# Altium project Power Board.PrjPcb
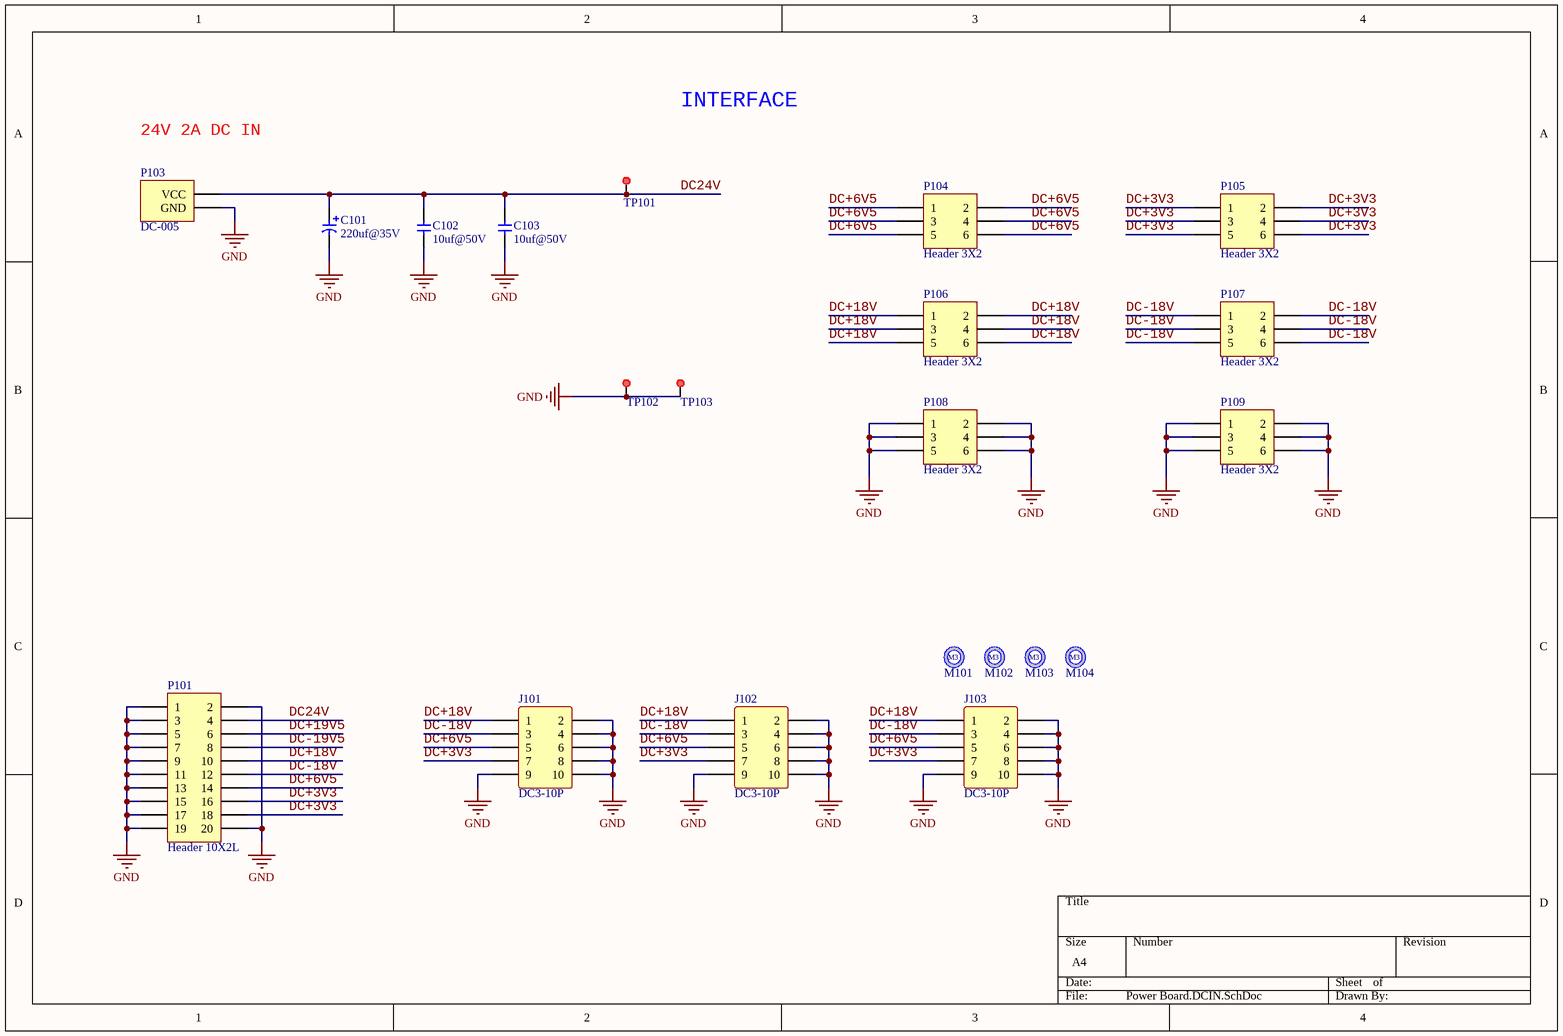
[diagram p0: Power Board.DCIN.SchDoc]
3 sheets, 67 parts. Net scope: global (net labels, ports and power ports of the same name join across sheets).
Board file: Power Board.PcbDoc
Sheets:
  Power Board.DCIN.SchDoc
  Power Board.LDO.SchDoc
  Power Board.DCDC2.SchDoc

## Sheet Power Board.DCIN.SchDoc
size A4; SheetNumber: 1; SheetTotal: 2

### Parts
C101  value 220uf@35V  [C8X12]  (hidden comment: Cap2)
C102  value 10uf@50V  [C1206]  (hidden comment: Cap)
C103  value 10uf@50V  [C1206]  (hidden comment: Cap)
J101  DC3-10P  [DC3-10P]
J102  DC3-10P  [DC3-10P]
J103  DC3-10P  [DC3-10P]
M101  M3  [M3-3.2X5]  (value not drawn)
M102  M3  [M3-3.2X5]  (value not drawn)
M103  M3  [M3-3.2X5]  (value not drawn)
M104  M3  [M3-3.2X5]  (value not drawn)
P101  Header 10X2L  [HDR2X10LML]
P103  DC-005  [DC-005]
P104  Header 3X2  [HDR2X3]
P105  Header 3X2  [HDR2X3]
P106  Header 3X2  [HDR2X3]
P107  Header 3X2  [HDR2X3]
P108  Header 3X2  [HDR2X3]
P109  Header 3X2  [HDR2X3]
TP101  TestPoint  [TestPoint-THM1.0-L]  (value not drawn)
TP102  TestPoint  [TestPoint-THM1.0-L]  (value not drawn)
TP103  TestPoint  [TestPoint-THM1.0-L]  (value not drawn)

### Nets
GND: C101.2 C102.1 C103.1 J101.2 J101.4 J101.6 J101.8 J101.9 J101.10 J102.2 J102.4 J102.6 J102.8 J102.9 J102.10 J103.2 J103.4 J103.6 J103.8 J103.9 J103.10 P101.1 P101.2 P101.3 P101.5 P101.7 P101.9 P101.11 P101.13 P101.15 P101.17 P101.19 P101.20 P103.2(GND) P108.1 P108.2 P108.3 P108.4 P108.5 P108.6 P109.1 P109.2 P109.3 P109.4 P109.5 P109.6 TP102.1 TP103.1
DC24V: C101.1 C102.2 C103.2 P101.4 P103.1(VCC) TP101.1
DC+3V3: J101.7 J102.7 J103.7 P101.16 P101.18 P105.1 P105.2 P105.3 P105.4 P105.5 P105.6
DC+6V5: J101.5 J102.5 J103.5 P101.14 P104.1 P104.2 P104.3 P104.4 P104.5 P104.6
DC+18V: J101.1 J102.1 J103.1 P101.10 P106.1 P106.2 P106.3 P106.4 P106.5 P106.6
DC+19V5: P101.6
DC-18V: J101.3 J102.3 J103.3 P101.12 P107.1 P107.2 P107.3 P107.4 P107.5 P107.6
DC-19V5: P101.8

### Notes on the sheet
- INTERFACE
- 24V 2A DC IN

### Library data of the parts
P101 = Header 10X2L: Header, 10-Pin, Dual row, Pin 1 on Left
P104-P109 = Header 3X2: Header, 3-Pin, Dual row
TP101-TP103 = TestPoint: 测试点

## Sheet Power Board.LDO.SchDoc
size A4; SheetNumber: 2; SheetTotal: 2
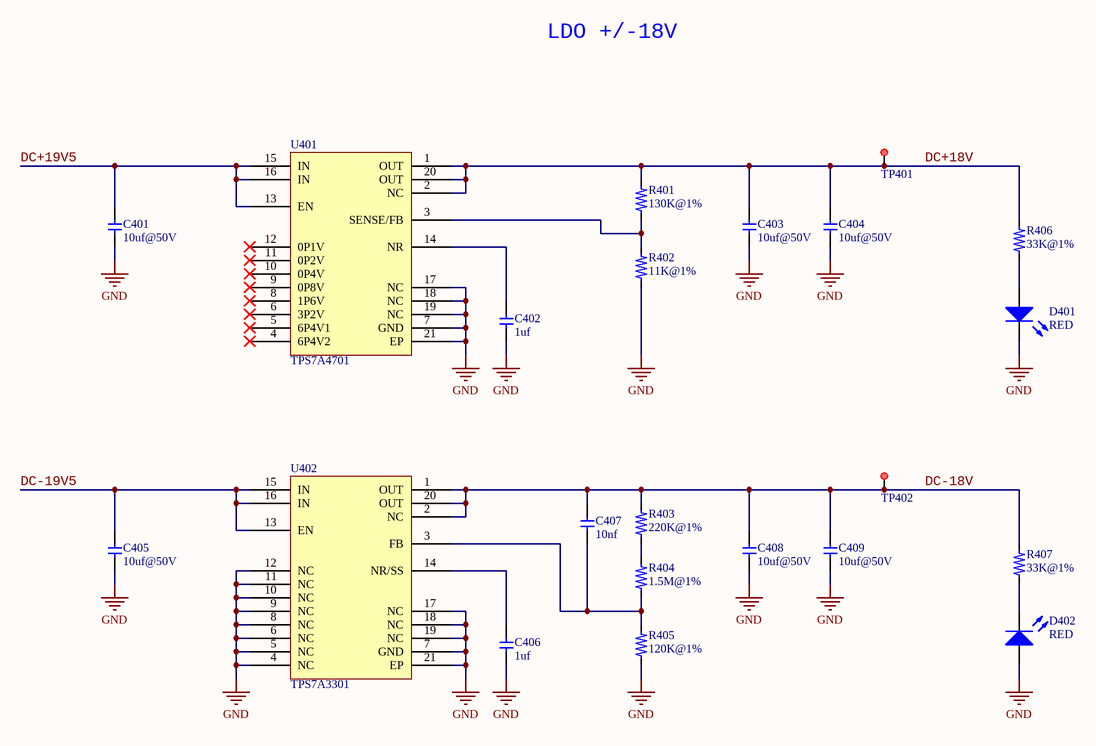
[diagram p1: Power Board.LDO.SchDoc]

### Parts
C401  value 10uf@50V  [C1206]  (hidden comment: Cap)
C402  value 1uf  [C0603]  (hidden comment: Cap)
C403  value 10uf@50V  [C1206]  (hidden comment: Cap)
C404  value 10uf@50V  [C1206]  (hidden comment: Cap)
C405  value 10uf@50V  [C1206]  (hidden comment: Cap)
C406  value 1uf  [C0603]  (hidden comment: Cap)
C407  value 10nf  [C0603]  (hidden comment: Cap)
C408  value 10uf@50V  [C1206]  (hidden comment: Cap)
C409  value 10uf@50V  [C1206]  (hidden comment: Cap)
D401  value RED  [LED0603]  (hidden comment: LED)
D402  value RED  [LED0603]  (hidden comment: LED)
R401  value 130K@1%  [R0603]  (hidden comment: Res)
R402  value 11K@1%  [R0603]  (hidden comment: Res)
R403  value 220K@1%  [R0603]  (hidden comment: Res)
R404  value 1.5M@1%  [R0603]  (hidden comment: Res)
R405  value 120K@1%  [R0603]  (hidden comment: Res)
R406  value 33K@1%  [R0603]  (hidden comment: Res)
R407  value 33K@1%  [R0603]  (hidden comment: Res)
TP401  TestPoint  [TestPoint-THM1.0-L]  (value not drawn)
TP402  TestPoint  [TestPoint-THM1.0-L]  (value not drawn)
U401  TPS7A4701  [TPS7A4701-QFN20]
U402  TPS7A3301  [TPS7A3301-QFN20]

### Nets
GND: C401.1 C402.2 C403.1 C404.1 C405.1 C406.2 C408.1 C409.1 D401.2(K) D402.1(A) R402.1 R405.1 U401.7(GND) U401.17(NC) U401.18(NC) U401.19(NC) U401.21(EP) U402.4(NC) U402.5(NC) U402.6(NC) U402.7(GND) U402.8(NC) U402.9(NC) U402.10(NC) U402.11(NC) U402.12(NC) U402.17(NC) U402.18(NC) U402.19(NC) U402.21(EP)
DC+18V: C403.2 C404.2 R401.2 R406.2 TP401.1 U401.1(OUT) U401.2(NC) U401.20(OUT)
DC+19V5: C401.2 U401.13(EN) U401.15(IN) U401.16(IN)
DC-18V: C407.2 C408.2 C409.2 R403.2 R407.2 TP402.1 U402.1(OUT) U402.2(NC) U402.20(OUT)
DC-19V5: C405.2 U402.13(EN) U402.15(IN) U402.16(IN)
NetC402_1: C402.1 U401.14(NR)
NetC406_1: C406.1 U402.14(NR/SS)
NetC407_1: C407.1 R404.1 R405.2 U402.3(FB)
NetD401_1: D401.1(A) R406.1
NetD402_2: D402.2(K) R407.1
NetR401_1: R401.1 R402.2 U401.3(SENSE/FB)
NetR403_1: R403.1 R404.2

Not connected (* = marked no-connect by the designer): U401 4(6P4V2)* 5(6P4V1)* 6(3P2V)* 8(1P6V)* 9(0P8V)* 10(0P4V)* 11(0P2V)* 12(0P1V)*

### Notes on the sheet
- LDO +/-18V

### Library data of the parts
R401-R407 = Res: 电阻
TP401 TP402 = TestPoint: 测试点
U401 = TPS7A4701: TPS7A470x 36-V, 1-A, 4-µVRMS, RF LDO Voltage Regulator
U402 = TPS7A3301: TPS7A33 –36-V, 1-A, Ultralow-Noise Negative Voltage Regulator

## Sheet Power Board.DCDC2.SchDoc
size A4; SheetNumber: 2; SheetTotal: 2
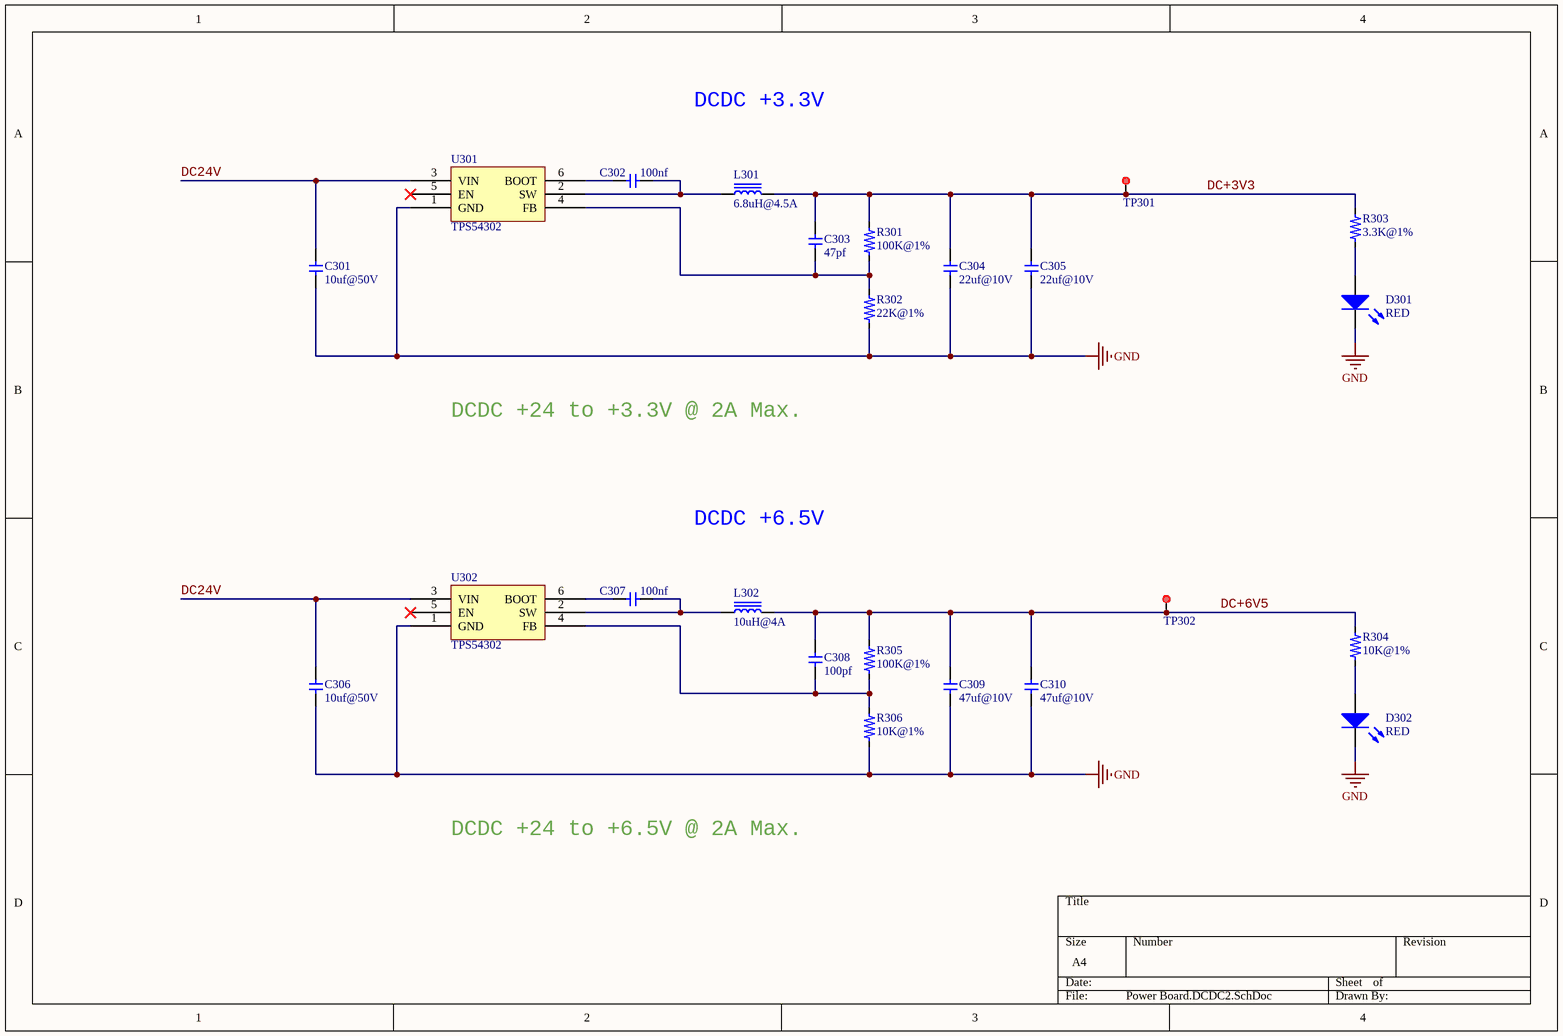
[diagram p2: Power Board.DCDC2.SchDoc]

### Parts
C301  value 10uf@50V  [C1206]  (hidden comment: Cap)
C302  value 100nf  [C0603]  (hidden comment: Cap)
C303  value 47pf  [C0603]  (hidden comment: Cap)
C304  value 22uf@10V  [C1206]  (hidden comment: Cap)
C305  value 22uf@10V  [C1206]  (hidden comment: Cap)
C306  value 10uf@50V  [C1206]  (hidden comment: Cap)
C307  value 100nf  [C0603]  (hidden comment: Cap)
C308  value 100pf  [C0603]  (hidden comment: Cap)
C309  value 47uf@10V  [C1206]  (hidden comment: Cap)
C310  value 47uf@10V  [C1206]  (hidden comment: Cap)
D301  value RED  [LED0603]  (hidden comment: LED)
D302  value RED  [LED0603]  (hidden comment: LED)
L301  value 6.8uH@4.5A  [L06063]  (hidden comment: Inductor Iron)
L302  value 10uH@4A  [L06063]  (hidden comment: Inductor Iron)
R301  value 100K@1%  [R0603]  (hidden comment: Res)
R302  value 22K@1%  [R0603]  (hidden comment: Res)
R303  value 3.3K@1%  [R0603]  (hidden comment: Res)
R304  value 10K@1%  [R0603]  (hidden comment: Res)
R305  value 100K@1%  [R0603]  (hidden comment: Res)
R306  value 10K@1%  [R0603]  (hidden comment: Res)
TP301  TestPoint  [TestPoint-THM1.0-L]  (value not drawn)
TP302  TestPoint  [TestPoint-THM1.0-L]  (value not drawn)
U301  TPS54302  [TPS54302-SOT23-6]
U302  TPS54302  [TPS54302-SOT23-6]

### Nets
GND: C301.1 C304.1 C305.1 C306.1 C309.1 C310.1 D301.2(K) D302.2(K) R302.1 R306.1 U301.1(GND) U302.1(GND)
DC24V: C301.2 C306.2 U301.3(VIN) U302.3(VIN)
DC+3V3: C303.1 C304.2 C305.2 L301.2 R301.2 R303.2 TP301.1
DC+6V5: C308.1 C309.2 C310.2 L302.2 R304.2 R305.2 TP302.1
NetC302_1: C302.1 L301.1 U301.2(SW)
NetC302_2: C302.2 U301.6(BOOT)
NetC303_2: C303.2 R301.1 R302.2 U301.4(FB)
NetC307_1: C307.1 L302.1 U302.2(SW)
NetC307_2: C307.2 U302.6(BOOT)
NetC308_2: C308.2 R305.1 R306.2 U302.4(FB)
NetD301_1: D301.1(A) R303.1
NetD302_1: D302.1(A) R304.1

Not connected (* = marked no-connect by the designer): U301 5(EN)*; U302 5(EN)*

### Notes on the sheet
- DCDC +3.3V
- DCDC +24 to +3.3V @ 2A Max.
- DCDC +6.5V
- DCDC +24 to +6.5V @ 2A Max.

### Library data of the parts
L301 L302 = Inductor Iron: Magnetic-Core Inductor
R301-R306 = Res: 电阻
TP301 TP302 = TestPoint: 测试点
U301 U302 = TPS54302: TPS54302 4.5-V to 28-V Input, 3-A Output, EMI-Friendly Synchronous Step-Down Converter

## Nets that join several sheets
GND: Power Board.DCIN (48 pins), Power Board.LDO (30 pins), Power Board.DCDC2 (12 pins)
DC24V: Power Board.DCIN (6 pins), Power Board.DCDC2 (C301.2 C306.2 U301.3 U302.3)
DC+3V3: Power Board.DCIN (11 pins), Power Board.DCDC2 (7 pins)
DC+6V5: Power Board.DCIN (10 pins), Power Board.DCDC2 (7 pins)
DC+18V: Power Board.DCIN (10 pins), Power Board.LDO (8 pins)
DC+19V5: Power Board.DCIN (P101.6), Power Board.LDO (C401.2 U401.13 U401.15 U401.16)
DC-18V: Power Board.DCIN (10 pins), Power Board.LDO (9 pins)
DC-19V5: Power Board.DCIN (P101.8), Power Board.LDO (C405.2 U402.13 U402.15 U402.16)